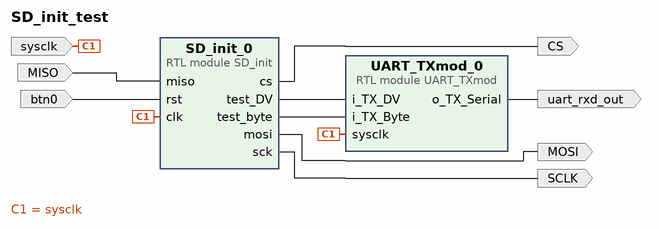
[diagram p0: block diagram of the top level]
# Vivado block design SD_init_test, xc7a35tcpg236-1, Vivado 2024.2
create_bd_design SD_init_test

create_bd_port -dir I sysclk
create_bd_port -dir I MISO
create_bd_port -dir O MOSI
create_bd_port -dir I btn0
create_bd_port -dir O SCLK
create_bd_port -dir O CS
create_bd_port -dir O uart_rxd_out

create_bd_cell -type module -reference UART_TXmod UART_TXmod_0
create_bd_cell -type module -reference SD_init SD_init_0

# ---- connections ----

connect_bd_net [get_bd_ports MISO] [get_bd_pins SD_init_0/miso]
connect_bd_net [get_bd_pins SD_init_0/cs] [get_bd_ports CS]
connect_bd_net [get_bd_pins SD_init_0/mosi] [get_bd_ports MOSI]
connect_bd_net [get_bd_pins SD_init_0/sck] [get_bd_ports SCLK]
connect_bd_net [get_bd_pins SD_init_0/test_DV] [get_bd_pins UART_TXmod_0/i_TX_DV]
connect_bd_net [get_bd_pins SD_init_0/test_byte] [get_bd_pins UART_TXmod_0/i_TX_Byte]
connect_bd_net [get_bd_pins UART_TXmod_0/o_TX_Serial] [get_bd_ports uart_rxd_out]
connect_bd_net -net btn0_1 [get_bd_ports btn0] [get_bd_pins SD_init_0/rst]
connect_bd_net [get_bd_ports sysclk] [get_bd_pins UART_TXmod_0/sysclk] [get_bd_pins SD_init_0/clk]

validate_bd_design
save_bd_design
